# EAGLE design TESTESP1SH (EAGLE 6.5.0)
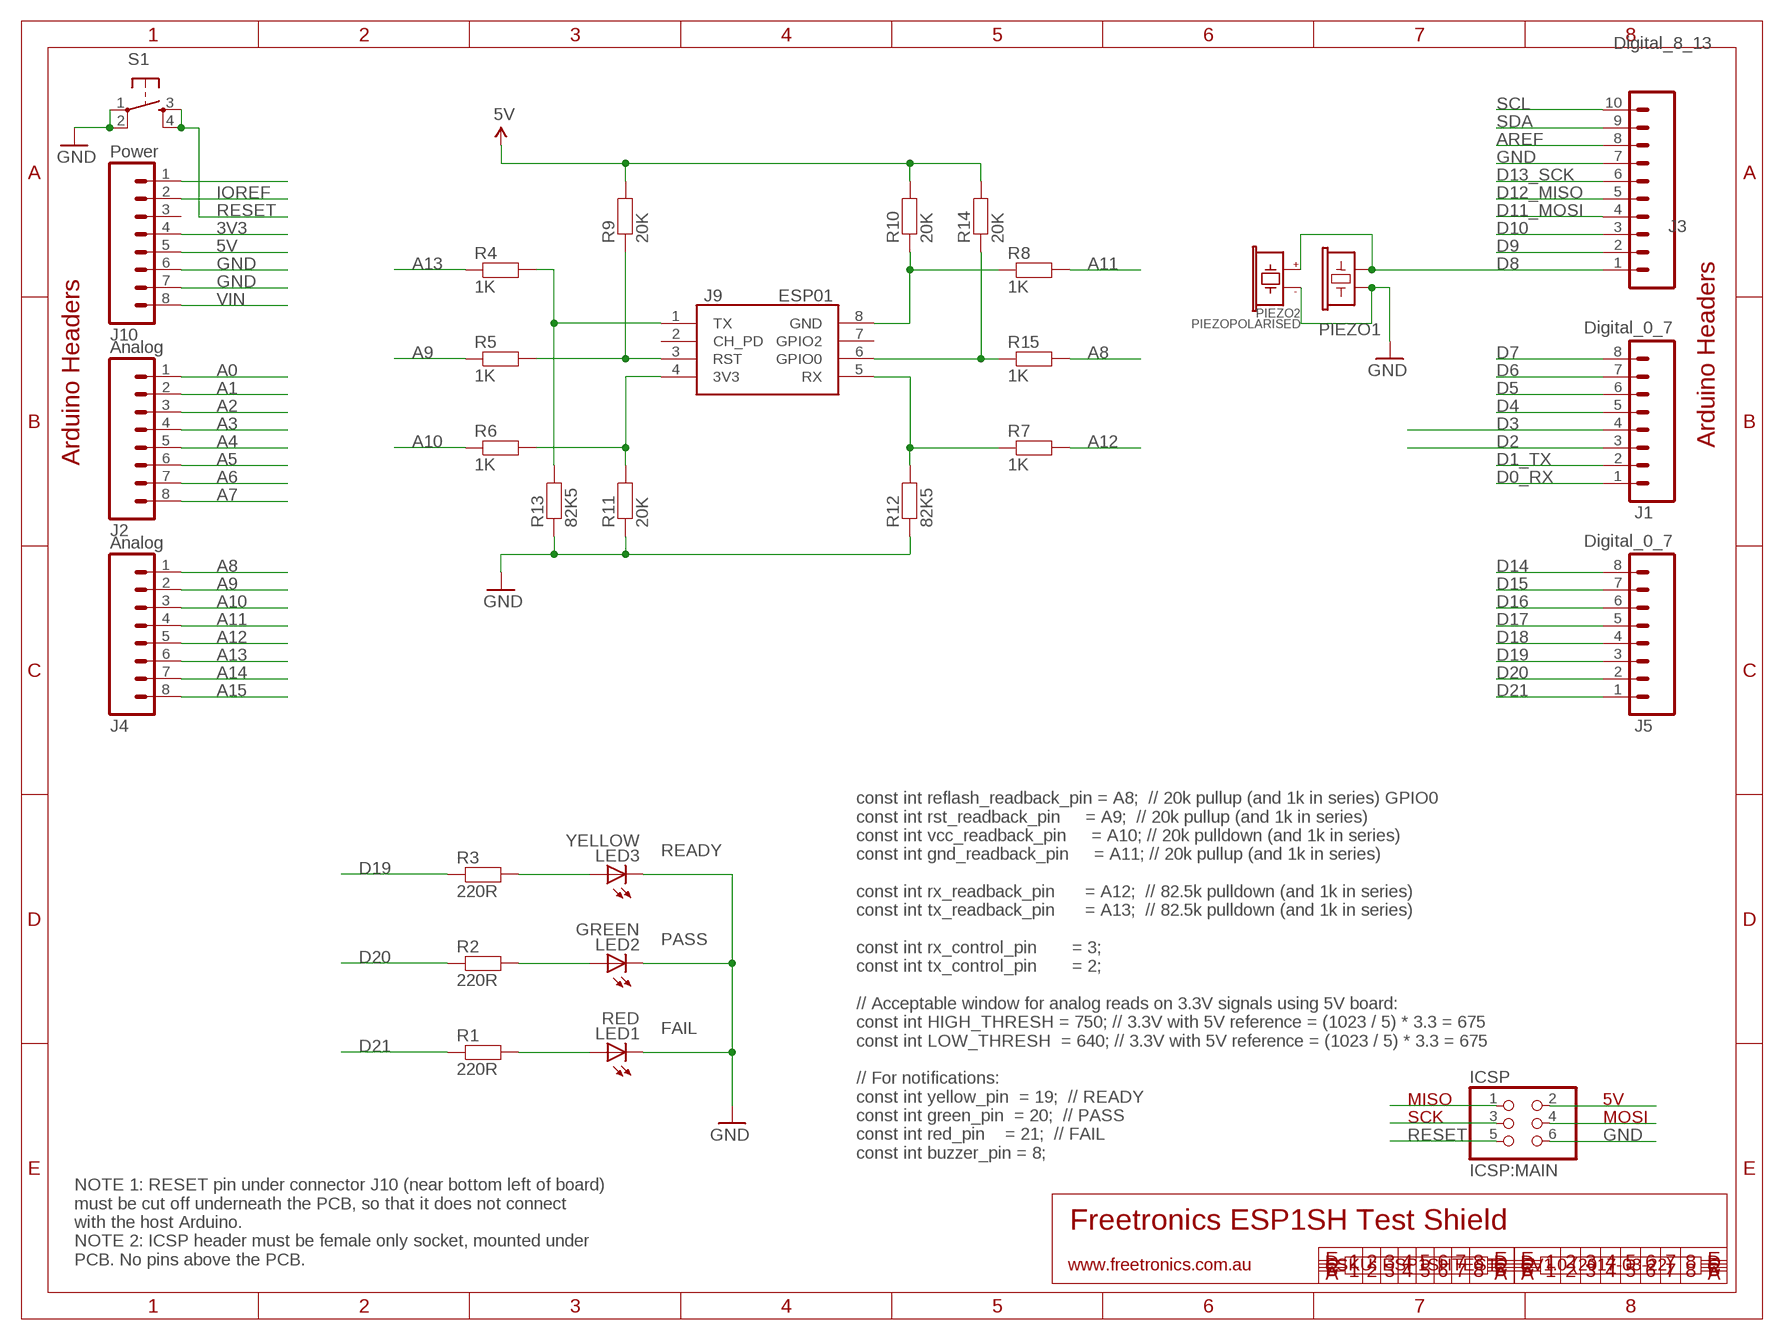
[diagram p0: schematic, sheet 1]

## Parts
ICSP  ICSP:MAIN  PINHD-2X3  [2X03]
J1  Digital_0_7  M08  [1X08]
J2  Analog  M08  [1X08]
J3  Digital_8_13  M100.1  [1X10]
J4  Analog  M08  [1X08]
J5  Digital_0_7  M08  [1X08]
J9  ESP01  [ESP01]
J10  Power  M08  [1X08]
LED1  RED  LED0603  [LED-0603]
LED2  GREEN  LED0603  [LED-0603]
LED3  YELLOW  LED0603  [LED-0603]
PIEZO1  BUZZERSMD12X12  [BUZZER-12X12-SMT]
PIEZO2  PIEZOPOLARISED  [PIEZO12MMWIDEPOLARISED]
R1  220R  RESISTOR0603  [0603]
R2  220R  RESISTOR0603  [0603]
R3  220R  RESISTOR0603  [0603]
R4  1K  RESISTOR0603  [0603]
R5  1K  RESISTOR0603  [0603]
R6  1K  RESISTOR0603  [0603]
R7  1K  RESISTOR0603  [0603]
R8  1K  RESISTOR0603  [0603]
R9  20K  RESISTOR0603  [0603]
R10  20K  RESISTOR0603  [0603]
R11  20K  RESISTOR0603  [0603]
R12  82K5  RESISTOR0603  [0603]
R13  82K5  RESISTOR0603  [0603]
R14  20K  RESISTOR0603  [0603]
R15  1K  RESISTOR0603  [0603]
S1  TAC_SWITCHPTH  [TACTILE-PTH]

## Nets
3V3: J10.4
5V: J10.5 R9.2 R10.2 R14.2
A0: J2.1
A1: J2.2
A2: J2.3
A3: J2.4
A4: J2.5
A5: J2.6
A6: J2.7
A7: J2.8
A8: J4.1 R15.2
A9: J4.2 R5.1
A10: J4.3 R6.1
A11: J4.4 R8.2
A12: J4.5 R7.2
A13: J4.6 R4.1
A14: J4.7
A15: J4.8
AREF: J3.8
D0_RX: J1.1
D1_TX: J1.2
D2: J1.3
D3: J1.4
D4: J1.5
D5: J1.6
D6: J1.7
D7: J1.8
D8: J3.1 PIEZO1.1 PIEZO2.1(+)
D9: J3.2
D10: J3.3
D11_MOSI: J3.4
D12_MISO: J3.5
D13_SCK: J3.6
D14: J5.8
D15: J5.7
D16: J5.6
D17: J5.5
D18: J5.4
D19: J5.3 R3.1
D20: J5.2 R2.1
D21: J5.1 R1.1
GND: ICSP.6 J3.7 J10.6 J10.7 LED1.C LED2.C LED3.C PIEZO1.2 PIEZO2.2(-) R11.1 R12.1 R13.1 S1.1 S1.2
IOREF: J10.2
N$1: LED3.A R3.2
N$2: LED2.A R2.2
N$3: LED1.A R1.2
N$4: J9.3(RST) R5.2 R9.1
N$5: J9.8(GND) R8.1 R10.1
N$6: J9.4(3V3) R6.2 R11.2
N$7: J9.5(RX) R7.1 R12.2
N$8: J9.1(TX) R4.2 R13.2
N$9: J9.6(GPIO0) R14.1 R15.1
N$186: ICSP.1
N$187: ICSP.3
N$197: ICSP.2
N$198: ICSP.4
N$314: J10.1
RESET: ICSP.5 S1.3 S1.4
SCL: J3.10
SDA: J3.9
VIN: J10.8
Unconnected: J9.2(CH_PD) J9.7(GPIO2) J10.3

## Notes on the sheet
- Arduino Headers
- Arduino Headers
- READY
- PASS
- FAIL
- MISO | 5V
- SCK | MOSI
- const int reflash_readback_pin = A8;  // 20k pullup (and 1k in series) GPIO0
  const int rst_readback_pin     = A9;  // 20k pullup (and 1k in series)
  const int vcc_readback_pin     = A10; // 20k pulldown (and 1k in series)
  const int gnd_readback_pin     = A11; // 20k pullup (and 1k in series)
  
  const int rx_readback_pin      = A12;  // 82.5k pulldown (and 1k in series)
  const int tx_readback_pin      = A13;  // 82.5k pulldown (and 1k in series)
  
  const int rx_control_pin       = 3;
  const int tx_control_pin       = 2;
  
  // Acceptable window for analog reads on 3.3V signals using 5V board:
  const int HIGH_THRESH = 750; // 3.3V with 5V reference = (1023 / 5) * 3.3 = 675
  const int LOW_THRESH  = 640; // 3.3V with 5V reference = (1023 / 5) * 3.3 = 675
  
  // For notifications:
  const int yellow_pin  = 19;  // READY
  const int green_pin  = 20;  // PASS
  const int red_pin    = 21;  // FAIL
  const int buzzer_pin = 8;
- Freetronics ESP1SH Test Shield
- NOTE 1: RESET pin under connector J10 (near bottom left of board)
  must be cut off underneath the PCB, so that it does not connect
  with the host Arduino.
  NOTE 2: ICSP header must be female only socket, mounted under
  PCB. No pins above the PCB.
- www.freetronics.com.au | SKU: ESP1SHTEST | V1.0 (2017-03-22)

## Library data of the parts
ICSP = pinhead:PINHD-2X3: PIN HEADER
J1 J5 = freetronics:M08: Header 8 Standard 8-pin 0.1" header. Use with straight break away headers (SKU : PRT-00116), right angle break away headers (PRT-00553), swiss pins (PRT-00743), machine pins (PRT-00117), and female headers (PRT-00115).
J2 J4 J10 = freetronics-master-v1:M08: Header 8 Standard 8-pin 0.1" header. Use with straight break away headers (SKU : PRT-00116), right angle break away headers (PRT-00553), swiss pins (PRT-00743), machine pins (PRT-00117), and female headers (PRT-00115).
J3 = freetronics-original:M10: Header 10 Standard 10-pin 0.1" header. Use with straight break away headers (SKU : PRT-00116), right angle break away headers (PRT-00553), swiss pins (PRT-00743), machine pins (PRT-00117), and female headers (PRT-00115).
J9 = freetronics-jon:ESP01
LED1-LED3 = freetronics-jon:LED: LEDs Standard schematic elements and footprints for 5mm, 3mm, 1206, and 0603 sized LEDs. 5mm - Spark Fun Electronics SKU : COM-00529 (and others)
PIEZO1 = freetronics-master-v1:BUZZER: Buzzer - Piezo Transducer
PIEZO2 = freetronics-jon:PIEZOPOLARISED
R1-R15 = freetronics-jon:RESISTOR: Resistor Basic schematic elements and footprints for 0603, 1206, and PTH 1/10th watt (small) resistors.
S1 = freetronics-master-v1:TAC_SWITCH: Momentary Switch Button commonly used for reset or general input. Spark Fun Electronics SKU : COM-00097

## Board
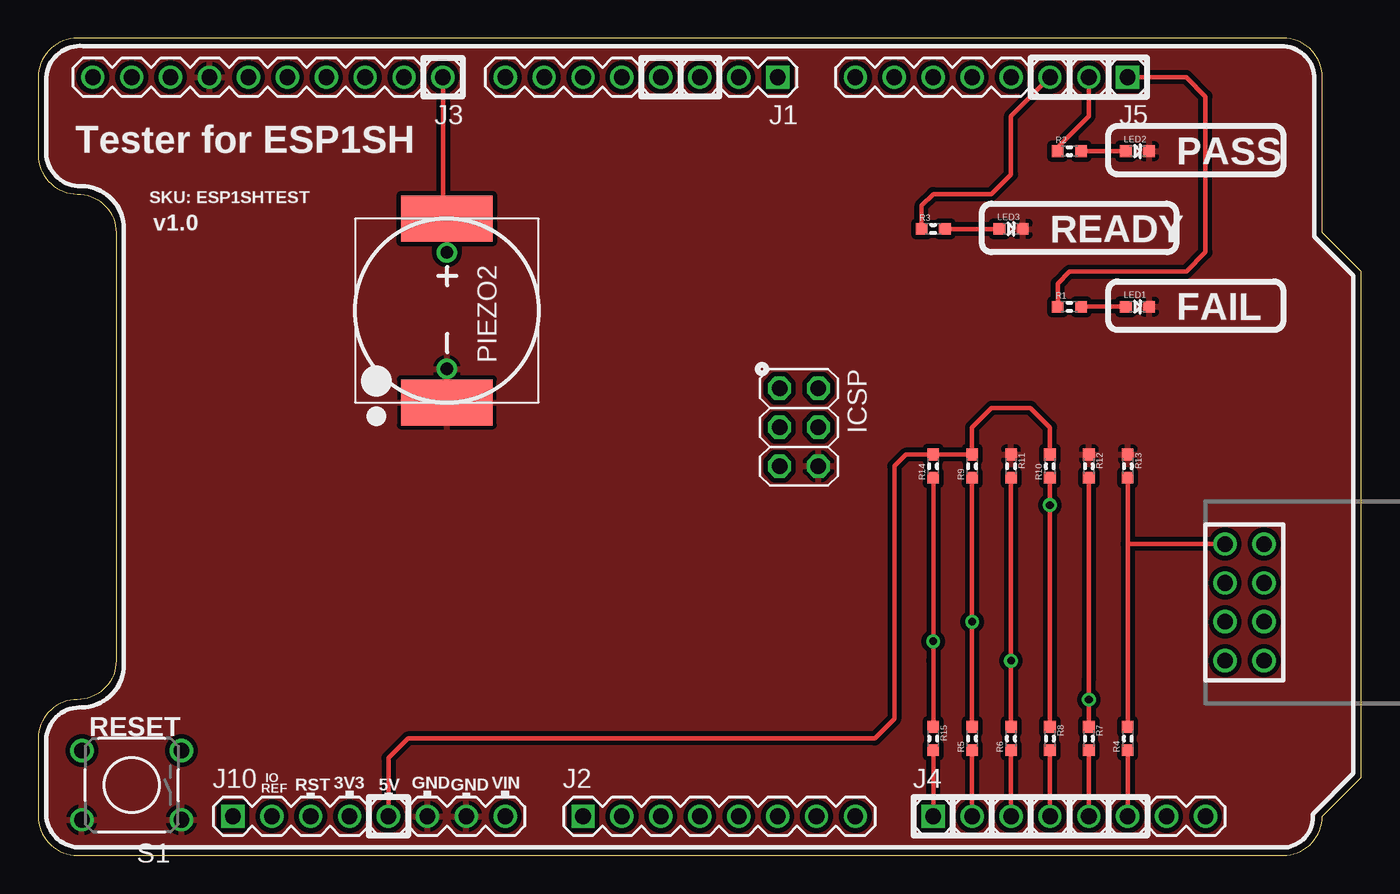
[diagram p1: board, top side]
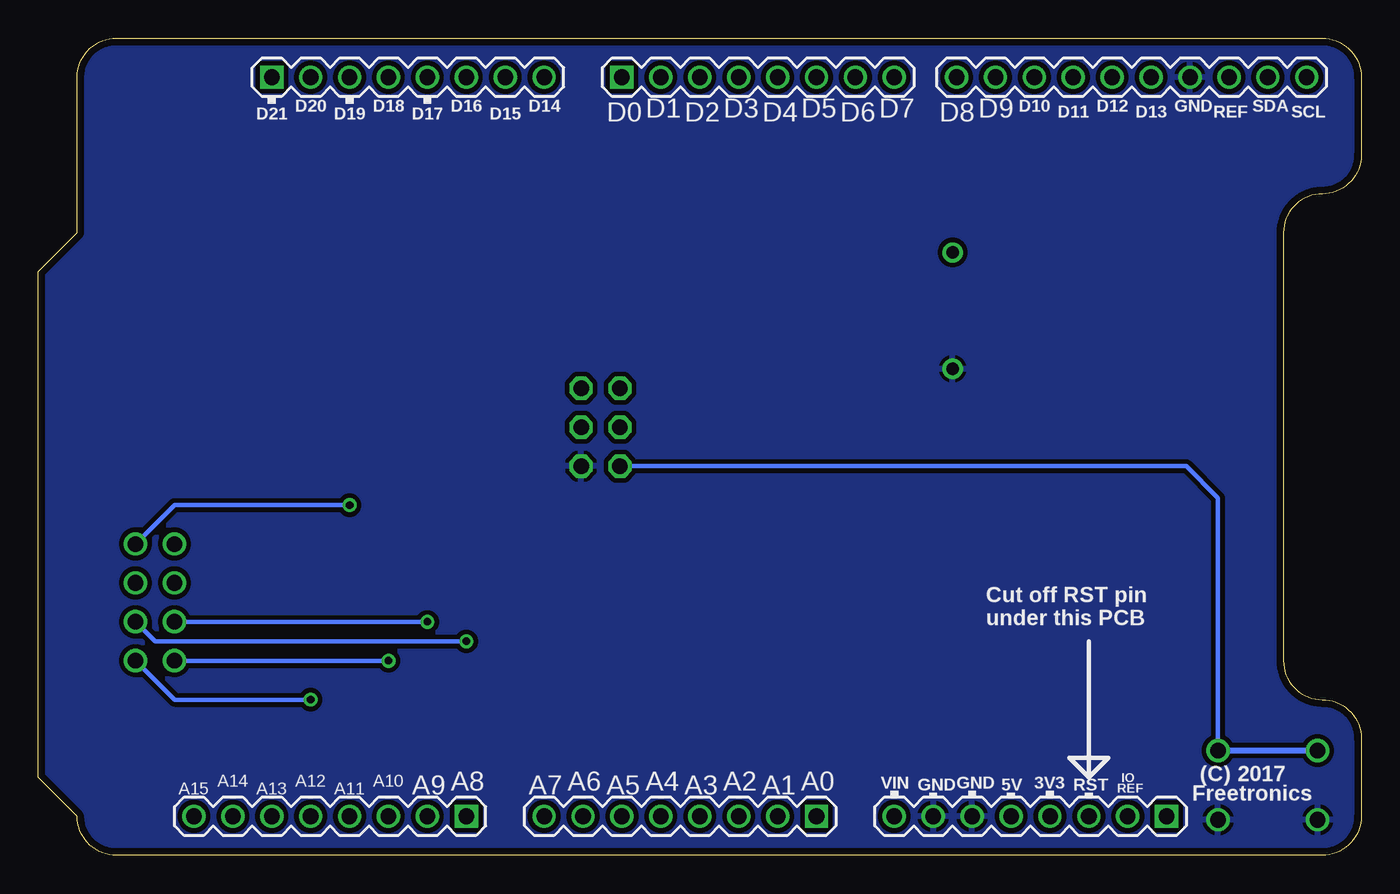
[diagram p2: board, bottom side, seen from below]

Size 86.36 x 53.34 mm. Coordinates in mm from the lower left corner, seen from the top.
Outline: 0,2.54 arc90 2.54,0 81.28,0 arc90 83.82,2.54 86.36,5.08 86.36,38.1 83.82,40.64 83.82,50.8 arc90 81.28,53.34 2.54,53.34 arc90 0,50.8 0,45.72 arc90 2.54,43.18 arc-90 5.08,40.64 5.08,12.7 arc-90 2.54,10.16 arc90 0,7.62 0,2.54
Copper layers (1*16): Top 0.035mm / dielectric 1.5mm / Bottom 0.035mm
Design rules "default *": minimum track width 10mil, minimum drill 24mil, track to track 12mil, track to pad 12mil, pad to pad 12mil, via to via 12mil, smd to smd 8mil, copper to edge 18mil, drill to drill 8mil, minimum pad ring 10mil, minimum via ring 8mil, stop-mask expansion 4mil, vias tented up to drill 0mil, thermal gap 10mil

### Footprints (pad centres in the part's own frame; a part is rotated, then mirrored left to right if it is on the bottom)
2X03 = drill 1.016 octagon: 1 -2.54,-1.27; 2 -2.54,1.27; 3 0,-1.27; 4 0,1.27; 5 2.54,-1.27; 6 2.54,1.27
1X08 = drill 1.016 square: 1 0,0 | drill 1.016: 2 2.54,0; 3 5.08,0; 4 7.62,0; 5 10.16,0; 6 12.7,0; 7 15.24,0; 8 17.78,0
1X10 = drill 1.016: 1 0,0; 2 2.54,0; 3 5.08,0; 4 7.62,0; 5 10.16,0; 6 12.7,0; 7 15.24,0; 8 17.78,0; 9 20.32,0; 10 22.86,0
ESP01 = drill 1.016: 1 -1.27,3.81; 2 -1.27,1.27; 3 -1.27,-1.27; 4 -1.27,-3.81; 5 1.27,-3.81; 6 1.27,-1.27; 7 1.27,1.27; 8 1.27,3.81
LED-0603 = smd 0.762 x 0.762: A -0.762,0; C 0.762,0
BUZZER-12X12-SMT = smd 3 x 6: 1 -6,0; 2 6,0
PIEZO12MMWIDEPOLARISED = drill 0.8: 1 -3.8,0; 2 3.8,0
0603 = smd 0.762 x 0.762: 1 -0.762,0; 2 0.762,0
TACTILE-PTH = drill 1.016: 1 -3.251,2.261; 2 3.251,2.261; 3 -3.251,-2.261; 4 3.251,-2.261

### Placement (x,y rotation side)
ICSP  49.66,27.94 270 top
J1  48.26,50.8 180 top
J2  35.56,2.54 0 top
J3  26.42,50.8 180 top
J4  58.42,2.54 0 top
J5  71.12,50.8 180 top
J9  78.74,16.51 0 top
J10  12.7,2.54 0 top
LED1  71.75,35.81 0 top
LED2  71.75,45.97 0 top
LED3  63.5,40.89 0 top
PIEZO1  26.67,35.56 270 top
PIEZO2  26.67,35.56 270 top
R1  67.31,35.81 0 top
R2  67.31,45.97 0 top
R3  58.42,40.89 0 top
R4  71.12,7.62 90 top
R5  60.96,7.62 90 top
R6  63.5,7.62 90 top
R7  68.58,7.62 270 top
R8  66.04,7.62 270 top
R9  60.96,25.4 90 top
R10  66.04,25.4 90 top
R11  63.5,25.4 270 top
R12  68.58,25.4 270 top
R13  71.12,25.4 270 top
R14  58.42,25.4 90 top
R15  58.42,7.62 270 top
S1  6.1,4.57 180 top

### Tracks (layer width: path | path; a pad name or v marks a point on that pad's centre or on a via)
5V
  Top 0.305: R10.2 66.04,27.94 64.77,29.21 62.23,29.21 60.96,27.94 R9.2 R14.2 56.64,26.16 55.88,25.4 55.88,8.89 54.61,7.62 24.13,7.62 22.86,6.35 J10.5
A8
  Top 0.305: J4.1 R15.2
A9
  Top 0.305: R5.1 J4.2
A10
  Top 0.305: R6.1 J4.3
A11
  Top 0.305: R8.2 J4.4
A12
  Top 0.305: R7.2 J4.5
A13
  Top 0.305: R4.1 J4.6
D8
  Top 0.305: J3.1 26.42,41.66 26.67,40.64 | PIEZO2.1 26.67,40.64 | 26.67,40.64 PIEZO1.1
D19
  Top 0.305: R3.1 57.66,42.42 58.42,43.18 62.23,43.18 63.5,44.45 63.5,48.26 J5.3
D20
  Top 0.305: R2.1 66.55,46.23 68.58,48.26 J5.2
D21
  Top 0.305: R1.1 66.55,37.34 67.31,38.1 74.93,38.1 76.2,39.37 76.2,49.53 74.93,50.8 J5.1
GND
  pour Bottom: 0,50.8 arc-74 2.54,53.34 81.28,53.34 arc-74 83.82,50.8 83.82,40.64 86.36,38.1 86.36,5.08 83.82,2.54 arc-74 81.28,0 1.27,0 arc-74 0,2.54 0,7.62 arc-90 2.54,10.16 arc90 5.08,12.7 5.08,40.64 arc90 2.54,43.18 arc-90 0,45.72
  pour Top: 0,50.8 arc-74 2.54,53.34 81.28,53.34 arc-74 83.82,50.8 83.82,40.64 86.36,38.1 86.36,5.08 83.82,2.54 arc-74 81.28,0 1.27,0 arc-74 0,2.54 0,7.62 arc-90 2.54,10.16 arc90 5.08,12.7 5.08,40.64 arc90 2.54,43.18 arc-90 0,45.72
N$1
  Top 0.305: LED3.A R3.2
N$2
  Top 0.305: LED2.A R2.2
N$3
  Top 0.305: LED1.A R1.2
N$4  (via drill 0.5)
  Top 0.305: R9.1 v60.96,15.24 60.96,13.97 R5.2
  Bottom 0.305: J9.3 v60.96,15.24
N$5  (via drill 0.5)
  Top 0.305: R10.1 v66.04,22.86 66.04,21.59 R8.1
  Bottom 0.305: J9.8 77.47,22.86 v66.04,22.86
N$6  (via drill 0.5)
  Top 0.305: R11.2 v63.5,12.7 63.5,11.43 R6.2
  Bottom 0.305: J9.4 v63.5,12.7
N$7  (via drill 0.5)
  Top 0.305: R12.2 68.58,11.43 v68.58,10.16 R7.1
  Bottom 0.305: J9.5 77.47,10.16 v68.58,10.16
N$8
  Top 0.305: R13.2 71.12,20.32 | 71.12,20.32 R4.2 | J9.1 71.12,20.32
N$9  (via drill 0.5)
  Top 0.305: R14.1 v58.42,13.97 58.42,12.7 R15.1
  Bottom 0.305: J9.6 78.74,13.97 v58.42,13.97
RESET
  Bottom 0.305: ICSP.5 11.43,25.4 9.35,23.32 S1.3
  Bottom 0.406: S1.3 S1.4

### Text on the board
tPlace: Tester for ESP1SH | PASS | SKU: ESP1SHTEST | v1.0 | READY | FAIL | RESET | IO | REF | RST | 3V3 | 5V | GND | GND | VIN
bPlace: SDA | GND | D12 | D10 | D14 | D16 | D18 | D20 | SCL | REF | D13 | D11 | D9 | D8 | D7 | D6 | D5 | D4 | D3 | D2 | D1 | D0 | D15 | D17 | D19 | D21 | Cut off RST pin / under this PCB | (C) 2017 | IO | Freetronics | REF | RST | 3V3 | 5V | GND | GND | VIN | A0 | A1 | A2 | A3 | A4 | A5 | A6 | A7 | A8 | A9 | A10 | A11 | A12 | A13 | A14 | A15